# Altium schematic sheet MB1-MCU-r1.0.SchDoc: STM32F103
size A; DrawnBy: MBoard team; DocumentNumber: 2; Revision: 1.1; SheetNumber: 2; SheetTotal: 7
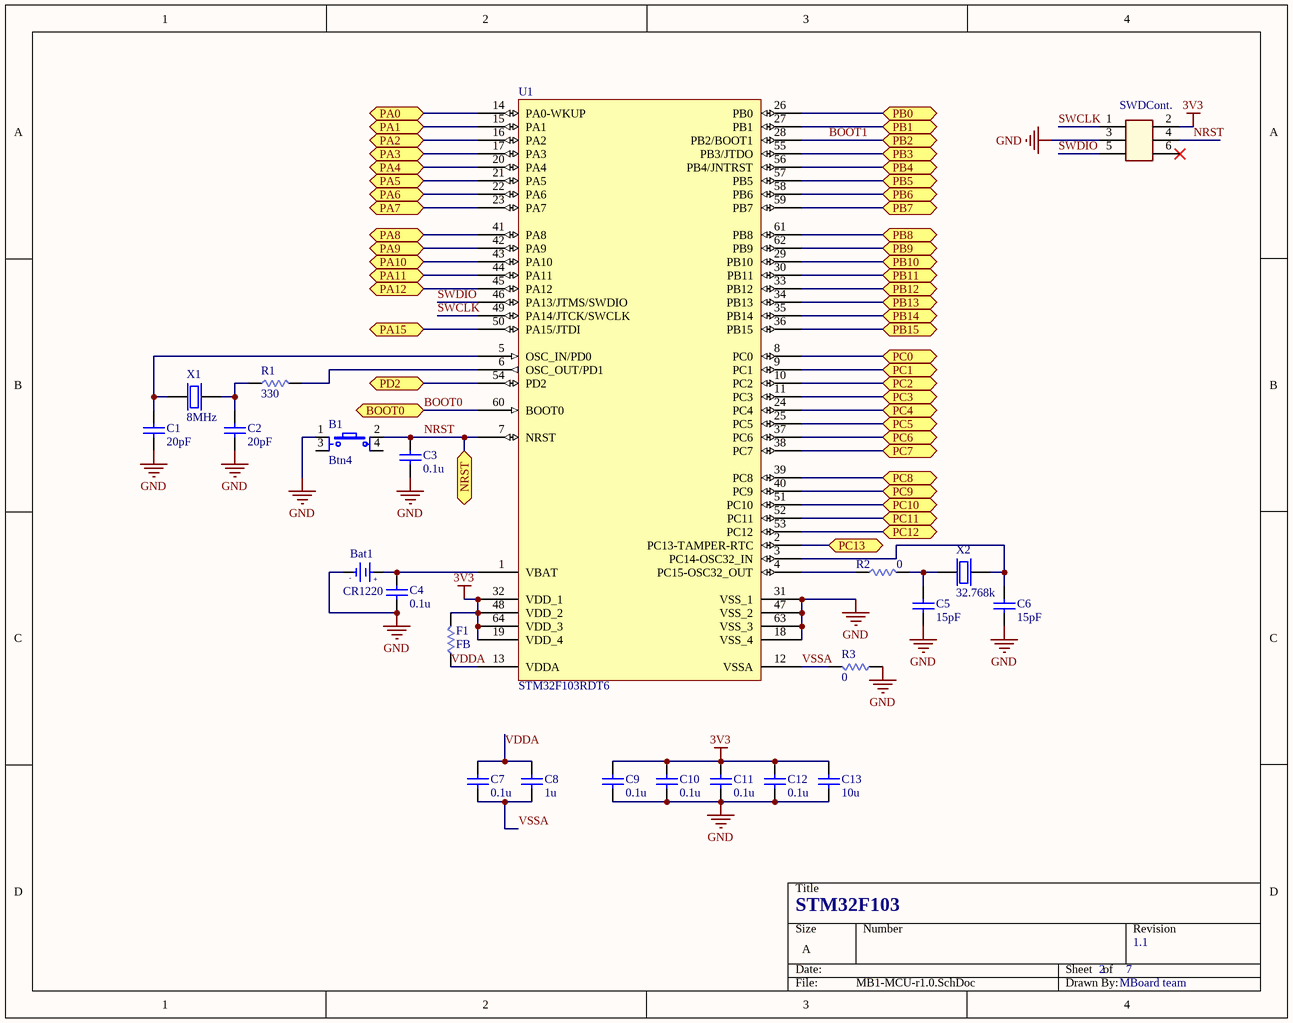
[diagram p0: MB1-MCU-r1.0.SchDoc]

## Parts
B1  Btn4  [Horizon_SW_4pin_rectangular]
Bat1  value CR1220  [PIN3VSOCKET-SMD]  (hidden comment: PIN 3V)
C1  value 20pF  [SM_0805_C_CERAMIC]  (hidden comment: CAP Ceramic)
C2  value 20pF  [SM_0805_C_CERAMIC]  (hidden comment: CAP Ceramic)
C3  value 0.1u  [SM_0805_C_CERAMIC]  (hidden comment: CAP Ceramic)
C4  value 0.1u  [SM_0805_C_CERAMIC]  (hidden comment: CAP Ceramic)
C5  value 15pF  [SM_0805_C_CERAMIC]  (hidden comment: CAP Ceramic)
C6  value 15pF  [SM_0805_C_CERAMIC]  (hidden comment: CAP Ceramic)
C7  value 0.1u  [SM_0805_C_CERAMIC]  (hidden comment: CAP Ceramic)
C8  value 1u  [SM_0805_C_CERAMIC]  (hidden comment: CAP Ceramic)
C9  value 0.1u  [SM_0805_C_CERAMIC]  (hidden comment: CAP Ceramic)
C10  value 0.1u  [SM_0805_C_CERAMIC]  (hidden comment: CAP Ceramic)
C11  value 0.1u  [SM_0805_C_CERAMIC]  (hidden comment: CAP Ceramic)
C12  value 0.1u  [SM_0805_C_CERAMIC]  (hidden comment: CAP Ceramic)
C13  value 10u  [SM_0805_C_CERAMIC]  (hidden comment: CAP Ceramic)
F1  value FB  [SM_0805_R]  (hidden comment: Ferrite bead)
R1  value 330  [SM_0805_R]
R2  value 0  [SM_0805_R]
R3  value 0  [SM_0805_R]
SWDCont.  SWD  [Hed3x2-RA]  (value not drawn)
U1  STM32F103RDT6  [LQFP64_L]
X1  value 8MHz  [HC49/US-SMD]  (hidden comment: Crystal 2 pin.)
X2  value 32.768k  [XT32-LOB]  (hidden comment: Crystal 32.768 k)

## Ports
BOOT0 (bidir), NRST (bidir), PA0 (bidir), PA1 (bidir), PA2 (bidir), PA3 (bidir), PA4 (bidir), PA5 (bidir), PA6 (bidir), PA7 (bidir), PA8 (bidir), PA9 (bidir), PA10 (bidir), PA11 (bidir), PA12 (bidir), PA15 (bidir), PB0 (bidir), PB1 (bidir), PB2 (bidir), PB3 (bidir), PB4 (bidir), PB5 (bidir), PB6 (bidir), PB7 (bidir), PB8 (bidir), PB9 (bidir), PB10 (bidir), PB11 (bidir), PB12 (bidir), PB13 (bidir), PB14 (bidir), PB15 (bidir), PC0 (bidir), PC1 (bidir), PC2 (bidir), PC3 (bidir), PC4 (bidir), PC5 (bidir), PC6 (bidir), PC7 (bidir), PC8 (bidir), PC9 (bidir), PC10 (bidir), PC11 (bidir), PC12 (bidir), PC13 (bidir), PD2 (bidir)

## Nets
3V3: C9.2 C10.2 C11.2 C12.2 C13.2 F1.2 SWDCont..2 U1.19(VDD_4) U1.32(VDD_1) U1.48(VDD_2) U1.64(VDD_3)
GND: B1.1(Tab) Bat1.2(GND) C1.1 C2.1 C3.1 C4.1 C5.1 C6.1 C9.1 C10.1 C11.1 C12.1 C13.1 R3.1 SWDCont..3 U1.18(VSS_4) U1.31(VSS_1) U1.47(VSS_2) U1.63(VSS_3)
BOOT0: U1.60(BOOT0) ; port BOOT0
BOOT1: U1.28(PB2/BOOT1) ; port PB2
NRST: B1.2(Tab) C3.2 SWDCont..4 U1.7(NRST) ; port NRST
PA0: U1.14(PA0-WKUP) ; port PA0
PA1: U1.15(PA1) ; port PA1
PA2: U1.16(PA2) ; port PA2
PA3: U1.17(PA3) ; port PA3
PA4: U1.20(PA4) ; port PA4
PA5: U1.21(PA5) ; port PA5
PA6: U1.22(PA6) ; port PA6
PA7: U1.23(PA7) ; port PA7
PA8: U1.41(PA8) ; port PA8
PA9: U1.42(PA9) ; port PA9
PA10: U1.43(PA10) ; port PA10
PA11: U1.44(PA11) ; port PA11
PA12: U1.45(PA12) ; port PA12
PA15: U1.50(PA15/JTDI) ; port PA15
PB0: U1.26(PB0) ; port PB0
PB1: U1.27(PB1) ; port PB1
PB3: U1.55(PB3/JTDO) ; port PB3
PB4: U1.56(PB4/JNTRST) ; port PB4
PB5: U1.57(PB5) ; port PB5
PB6: U1.58(PB6) ; port PB6
PB7: U1.59(PB7) ; port PB7
PB8: U1.61(PB8) ; port PB8
PB9: U1.62(PB9) ; port PB9
PB10: U1.29(PB10) ; port PB10
PB11: U1.30(PB11) ; port PB11
PB12: U1.33(PB12) ; port PB12
PB13: U1.34(PB13) ; port PB13
PB14: U1.35(PB14) ; port PB14
PB15: U1.36(PB15) ; port PB15
PC0: U1.8(PC0) ; port PC0
PC1: U1.9(PC1) ; port PC1
PC2: U1.10(PC2) ; port PC2
PC3: U1.11(PC3) ; port PC3
PC4: U1.24(PC4) ; port PC4
PC5: U1.25(PC5) ; port PC5
PC6: U1.37(PC6) ; port PC6
PC7: U1.38(PC7) ; port PC7
PC8: U1.39(PC8) ; port PC8
PC9: U1.40(PC9) ; port PC9
PC10: U1.51(PC10) ; port PC10
PC11: U1.52(PC11) ; port PC11
PC12: U1.53(PC12) ; port PC12
PC13: U1.2(PC13-TAMPER-RTC) ; port PC13
PD2: U1.54(PD2) ; port PD2
SWCLK: SWDCont..1 U1.49(PA14/JTCK/SWCLK)
SWDIO: SWDCont..5 U1.46(PA13/JTMS/SWDIO)
VDDA: C7.2 C8.2 F1.1 U1.13(VDDA)
VSSA: C7.1 C8.1 R3.2 U1.12(VSSA)
NetBat1_1: Bat1.1(+3V) C4.2 U1.1(VBAT)
NetC1_2: C1.2 U1.5(OSC_IN/PD0) X1.1(Xin)
NetC2_2: C2.2 R1.1 X1.2(Xout)
NetC5_2: C5.2 R2.2 X2.1(Xin)
NetC6_2: C6.2 U1.3(PC14-OSC32_IN) X2.2(Xout)
NetR1_2: R1.2 U1.6(OSC_OUT/PD1)
NetR2_1: R2.1 U1.4(PC15-OSC32_OUT)

Not connected (* = marked no-connect by the designer): B1 3(Tab) 4(Tab); SWDCont. 6*

## Notes on the sheet
- (in symbol PIN 3V) -; +

## Library data of the parts
Bat1 = PIN 3V: Battery 3VDC
C1-C13 = CAP Ceramic: Non-polarity ceramic capacitor; Published: 8-Jun-2000; LatestRevisionDate: 17-Jul-2002; LatestRevisionNote: Re-released for DXP Platform.; PackageReference: RAD-0.3; Publisher: Altium Limited; PackageDescription: Radial Cap, Thru-Hole; 2 Leads; 0.3 in Pin Spacing
F1 R1-R3 = R: Resistor; Published: 8-Jun-2000; LatestRevisionDate: 29-May-2009; LatestRevisionNote: IPC-7351 Footprint Added.; PackageReference: J1-0603; Publisher: Altium Limited; PackageDescription: Chip Resistor
SWDCont. = HD_3x2: Header, 3-pins/row, double row,
U1 = STM32F103RBT6: STM32 ARM-based 32-bit MCU with 128 Kbytes Flash, 64-pin LQFP, Industrial Temperature; Published: 30-May-2008; DatasheetVersion: rev6, Mar-2008; PackageVersion: Mar-2008; PackageReference: LQFP64; Publisher: Altium Limited; PackageDescription: 64-Pin Low-Profile Quad Flat Pack, 10 x 10 mm Body, 0.5 mm Pitch (LQFP64); ComponentLink1Description: Manufacturer Link; ComponentLink1URL: www.st.com/stm32; ComponentLink2Description: Datasheet; ComponentLink2URL: http://www.st.com/stonline/products/literature/ds/13587.pdf
X1 = XT2
X2 = XT32k